# Altium schematic sheet rfid_reader.SchDoc
size 297 x 209 mm; DrawnBy: Supun; Engineer: Supun; Organization: C3
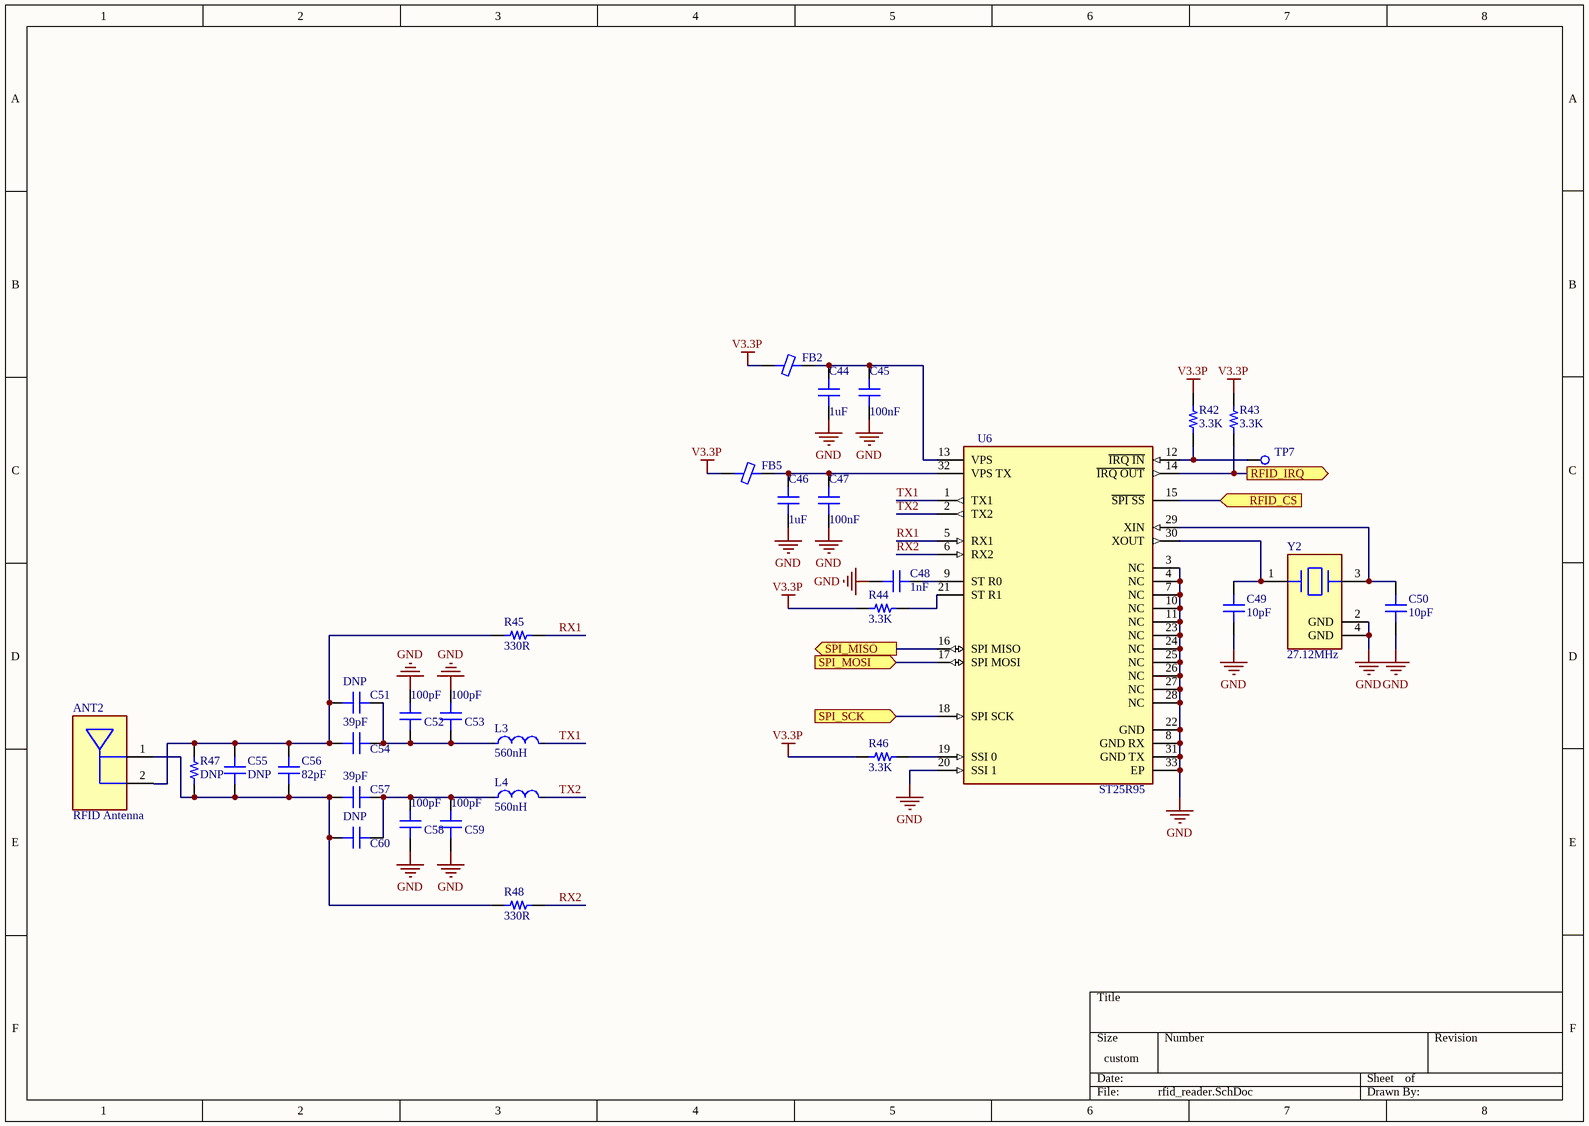
[diagram p0: rfid_reader.SchDoc]

## Parts
ANT2  RFID Antenna  [RFID_Antenna_3]
C44  1uF  [CAP 0603_1608]
C45  100nF  [CAP 0603_1608]
C46  1uF  [CAP 0603_1608]
C47  100nF  [CAP 0603_1608]
C48  1nF  [CAP 0603_1608]
C49  10pF  [CAP 0603_1608]
C50  10pF  [CAP 0603_1608]
C51  DNP  [CAP 0603_1608]
C52  100pF  [CAP 0603_1608]
C53  100pF  [CAP 0603_1608]
C54  39pF  [CAP 0603_1608]
C55  DNP  [CAP 0603_1608]
C56  82pF  [CAP 0603_1608]
C57  39pF  [CAP 0603_1608]
C58  100pF  [CAP 0603_1608]
C59  100pF  [CAP 0603_1608]
C60  DNP  [CAP 0603_1608]
FB2  (no value)  [Murata_BLM18-0_15-t0_8_MFG]
FB5  (no value)  [Murata_BLM18-0_15-t0_8_MFG]
L3  560nH  [IND 0806_2016]
L4  560nH  [IND 0806_2016]
R42  3.3K  [RES 0603_1608]
R43  3.3K  [RES 0603_1608]
R44  3.3K  [RES 0603_1608]
R45  330R  [RES 0603_1608]
R46  3.3K  [RES 0603_1608]
R47  DNP  [RES 0603_1608]
R48  330R  [RES 0603_1608]
TP7  Test Point  [TPSMD_S1]  (value not drawn)
U6  ST25R95  [STMicroelectronics_0_MFG]
Y2  27.12MHz  [ABRACON ABM8G]

## Ports
RFID_CS (in), RFID_IRQ (out), SPI_MISO (out), SPI_MOSI (in), SPI_SCK (in)

## Nets
GND: C44.1 C45.2 C46.1 C47.2 C48.1 C49.2 C50.2 C52.2 C53.2 C58.1 C59.1 U6.3(NC) U6.4(NC) U6.7(NC) U6.8(GND_RX) U6.10(NC) U6.11(NC) U6.20(SSI_1) U6.22(GND) U6.23(NC) U6.24(NC) U6.25(NC) U6.26(NC) U6.27(NC) U6.28(NC) U6.31(GND_TX) U6.33(EP) Y2.2(GND) Y2.4(GND)
V3.3P: FB2.1 FB5.1 R42.2 R43.2 R44.2 R46.2
RFID_CS: U6.15(~{SPI_SS}) ; port RFID_CS
RFID_IRQ: R43.1 U6.14(~{IRQ_OUT}) ; port RFID_IRQ
RX1: R45.2 U6.5(RX1)
RX2: R48.2 U6.6(RX2)
SPI_MISO: U6.16(SPI_MISO) ; port SPI_MISO
SPI_MOSI: U6.17(SPI_MOSI) ; port SPI_MOSI
SPI_SCK: U6.18(SPI_SCK) ; port SPI_SCK
TX1: L3.2 U6.1(TX1)
TX2: L4.2 U6.2(TX2)
NetANT2_1: ANT2.1 C55.1 C56.1 C57.2 C60.2 R47.1 R48.1
NetANT2_2: ANT2.2 C51.2 C54.2 C55.2 C56.2 R45.1 R47.2
NetC44_2: C44.2 C45.1 FB2.2 U6.13(VPS)
NetC46_2: C46.2 C47.1 FB5.2 U6.32(VPS_TX)
NetC48_2: C48.2 U6.9(ST_R0)
NetC49_1: C49.1 U6.30(XOUT) Y2.1
NetC50_1: C50.1 U6.29(XIN) Y2.3
NetC51_1: C51.1 C52.1 C53.1 C54.1 L3.1
NetC57_1: C57.1 C58.2 C59.2 C60.1 L4.1
NetR42_1: R42.1 TP7.1(TP) U6.12(~{IRQ_IN})
NetR44_1: R44.1 U6.21(ST_R1)
NetR46_1: R46.1 U6.19(SSI_0)

## Notes on the sheet
- Title
- Size:
- Date:
- A4
- Number:
- Time:
- Revision:
- Sheet
- of
- File:

## Library data of the parts
ANT2 = RFID PCB Antenna_2: 13.56MHz RFID Antenna 926.04 nH; MF: SAH; MP: *; Value: *
C44 C46 = Capacitor: SMT Capacitor; MF: Murata; MP: GRT188R61H105KE13D; Value: 1uF; Link: https://www.mouser.com/ProductDetail/Murata-Electronics/GRT188R61H105KE13D?qs=drgMNd%252BkGPNIxxtJByMGCg%3D%3D
C45 C47 = Capacitor: SMT Capacitor; MF: TDK; MP: CGA3E2X7R1E104K080AA; Value: 100nF; Link: https://www.mouser.com/ProductDetail/TDK/CGA3E2X7R1E104K080AA?qs=NRhsANhppD%2Fm7%2FOmmsm0vg%3D%3D
C48 = Capacitor: SMT Capacitor; MF: Murata; MP: GRM1885C1H102JA01D; Value: 1nF; Link: https://www.mouser.com/ProductDetail/Murata-Electronics/GRM1885C1H102JA01D?qs=H3lwsW1hsDtu9zD8AnV%2FOA%3D%3D
C49 C50 = Capacitor: SMT Capacitor; MF: Murata; MP: GRM1885C1H100GA01D; Value: 10pF; Link: https://www.mouser.com/ProductDetail/Murata-Electronics/GRM1885C1H100GA01D?qs=7Aw3Ng%2FBaE5snYvHxKANnw%3D%3D
C51 C54 C57 C60 = Capacitor: SMT Capacitor; MF: Murata; MP: GRM1885C1H390GA01J
  C51 C60: Value: DNP; Link: https://
  C54 C57: Value: 39pF; Link: https://www.mouser.com/ProductDetail/Murata-Electronics/GRM1885C1H390GA01J?qs=e4YKHiQKHyeNmbmJ2lwXdA%3D%3D
C52 C53 C58 C59 = Capacitor: SMT Capacitor; MF: Murata; MP: GRM1885C1H101GA01D; Value: 100pF; Link: https://www.mouser.com/ProductDetail/Murata-Electronics/GRM1885C1H101GA01D?qs=EsFwWZAkQ9fH40WPOVe8Rw%3D%3D
C55 = Capacitor: SMT Capacitor; MF: Murata; MP: GRM1885C1H560JA01J; Value: DNP; Link: https://
C56 = Capacitor: SMT Capacitor; MF: Murata; MP: GRM1885C1H820GA01D; Value: 82pF; Link: https://www.mouser.com/ProductDetail/Murata-Electronics/GRM1885C1H820GA01D?qs=wKgLNriqil4ECu1Lcc209g%3D%3D
FB2 FB5 = Ferrite Chip: SMT Ferrite Chip; MF: Murata Electronics; MP: BLM18RK601SN1D; Link: https://www.mouser.com/ProductDetail/Murata-Electronics/BLM18RK601SN1D?qs=y0QmqViQyZ9CJKFf5yPaOw%3D%3D
L3 L4 = Inductor_sm: Fixed Inductors 2.2uH 20% High Temp AEC-Q200; MF: Murata; MP: LQM21NNR56K10D; Value: 560nH; Link: https://www.mouser.com/ProductDetail/Murata-Electronics/LQM21NNR56K10D?qs=da47FVKfWTYye7WAouSyDQ%3D%3D
R42-R44 R46 = Resistor: SMT Resistor; MF: YAGEO; MP: AC0603FR-073K3L; Value: 3.3K; Link: https://www.mouser.com/ProductDetail/YAGEO/AC0603FR-073K3L?qs=yhV1fb9g%2FKZasQ4U0IUUCA%3D%3D
R45 R48 = Resistor: SMT Resistor; MF: YAGEO; MP: AC0603FR-07330RL; Value: 330R; Link: https://www.mouser.com/ProductDetail/YAGEO/AC0603FR-07330RL?qs=yhV1fb9g%2FKZrF%252BndswOPKw%3D%3D
R47 = Resistor: SMT Resistor; MF: Vishay; MP: CRCW06035R62FKEA; Value: DNP; Link: https://
U6 = ST25R95-VMD5T: RFID/NFC 13.56-MHz multi-protocol contactless transceiver IC; MF: STMicroelectronics; MP: ST25R95-VMD5T; Value: *; Link: https://www.mouser.com/ProductDetail/STMicroelectronics/ST25R95-VMD5T?qs=l7cgNqFNU1hwf5BC2e1e3A%3D%3D
Y2 = Crystal: Crystals AEC-Q200 CRYSTAL 4pin SMD; MF: ABRACON; MP: ABM8-27.120MHZ-10-D1G-T; Value: 27.12MHz; Link: https://www.mouser.com/ProductDetail/ABRACON/ABM8-27.120MHZ-10-D1G-T?qs=wnTfsH77Xs6%2FgBbo4S6Gaw%3D%3D
TP7 = Test Point: Link: https://